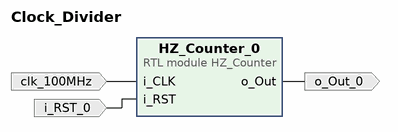
[diagram p0: block diagram of the top level]
# Vivado block design Clock_Divider, xc7z007sclg400-1, Vivado 2018.2
create_bd_design Clock_Divider

create_bd_port -dir I -type clk clk_100MHz
set_property -dict {CONFIG.FREQ_HZ 100000000} [get_bd_ports clk_100MHz]
create_bd_port -dir O o_Out_0
create_bd_port -dir I -type rst i_RST_0

create_bd_cell -type module -reference HZ_Counter HZ_Counter_0

# ---- connections ----

connect_bd_net [get_bd_ports clk_100MHz] [get_bd_pins HZ_Counter_0/i_CLK]
connect_bd_net [get_bd_pins HZ_Counter_0/o_Out] [get_bd_ports o_Out_0]
connect_bd_net -net i_RST_0_1 [get_bd_ports i_RST_0] [get_bd_pins HZ_Counter_0/i_RST]

validate_bd_design
save_bd_design
